# EAGLE design FanControl (EAGLE 6.5.0)
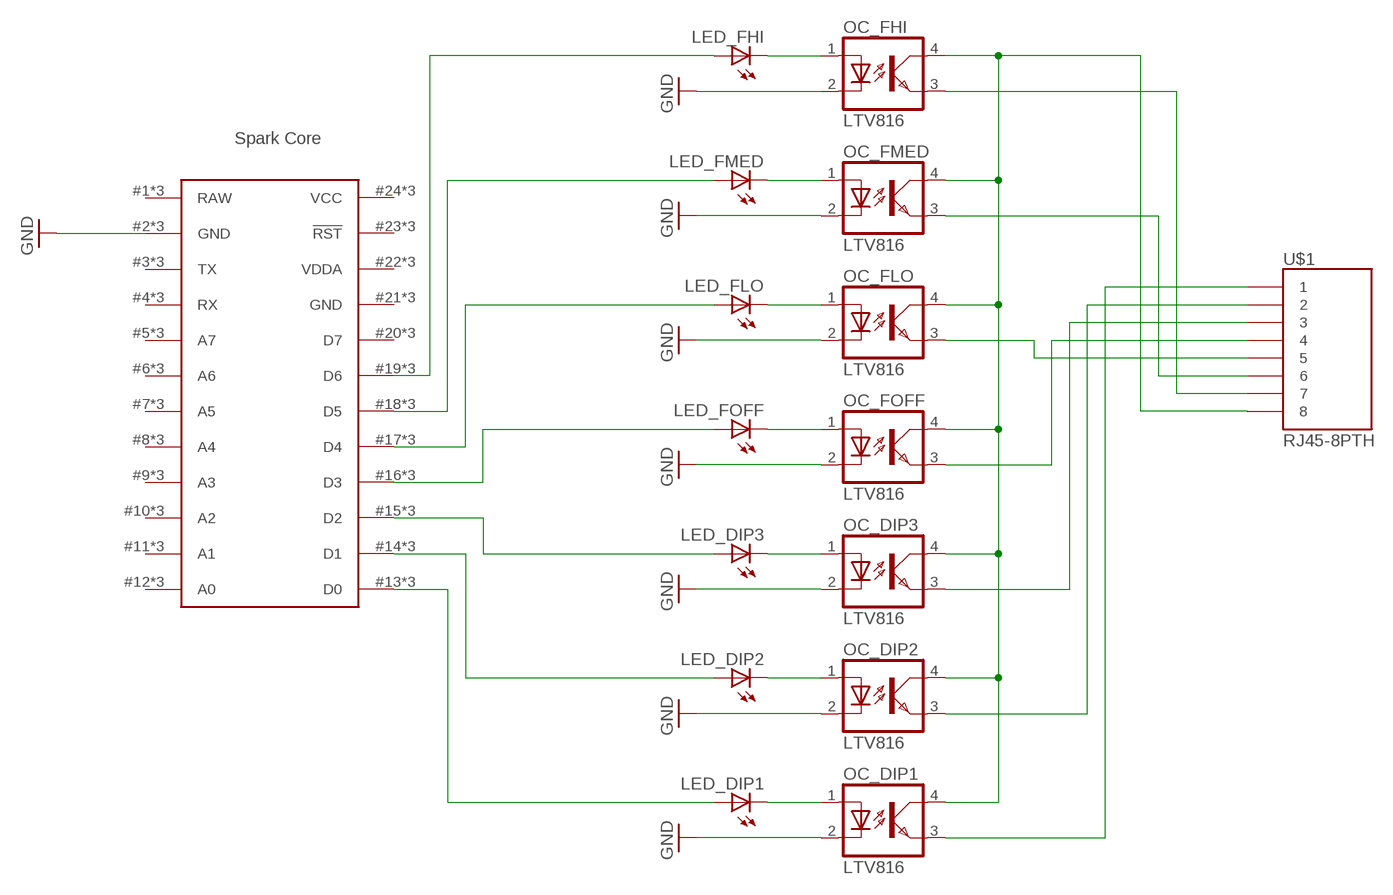
[diagram p0: schematic, sheet 1]

## Parts
LED_DIP1  LED3MM  [LED3MM]
LED_DIP2  LED3MM  [LED3MM]
LED_DIP3  LED3MM  [LED3MM]
LED_FHI  LED3MM  [LED3MM]
LED_FLO  LED3MM  [LED3MM]
LED_FMED  LED3MM  [LED3MM]
LED_FOFF  LED3MM  [LED3MM]
OC_DIP1  LTV816  [DIL04]
OC_DIP2  LTV816  [DIL04]
OC_DIP3  LTV816  [DIL04]
OC_FHI  LTV816  [DIL04]
OC_FLO  LTV816  [DIL04]
OC_FMED  LTV816  [DIL04]
OC_FOFF  LTV816  [DIL04]
U$1  RJ45-8PTH  [RJ45-8]
U$2  SPARK_CORE  [SPARK_CORE_STACKABLE]

## Nets
GND: OC_DIP1.2(C) OC_DIP2.2(C) OC_DIP3.2(C) OC_FHI.2(C) OC_FLO.2(C) OC_FMED.2(C) OC_FOFF.2(C) U$2.2(GND) U$2.#2(GND) U$2.@2(GND)
N$1: OC_DIP1.4(COL) OC_DIP2.4(COL) OC_DIP3.4(COL) OC_FHI.4(COL) OC_FLO.4(COL) OC_FMED.4(COL) OC_FOFF.4(COL) U$1.8
N$2: OC_DIP1.3(EMIT) U$1.1
N$3: OC_DIP2.3(EMIT) U$1.2
N$4: OC_DIP3.3(EMIT) U$1.3
N$5: OC_FOFF.3(EMIT) U$1.4
N$6: OC_FLO.3(EMIT) U$1.5
N$7: OC_FMED.3(EMIT) U$1.6
N$8: OC_FHI.3(EMIT) U$1.7
N$9: LED_FHI.K(C) OC_FHI.1(A)
N$10: LED_FMED.K(C) OC_FMED.1(A)
N$11: LED_FLO.K(C) OC_FLO.1(A)
N$12: LED_FOFF.K(C) OC_FOFF.1(A)
N$13: LED_DIP3.K(C) OC_DIP3.1(A)
N$14: LED_DIP2.K(C) OC_DIP2.1(A)
N$15: LED_DIP1.K(C) OC_DIP1.1(A)
N$16: LED_DIP1.A U$2.13(D0) U$2.#13(D0) U$2.@13(D0)
N$17: LED_DIP2.A U$2.14(D1) U$2.#14(D1) U$2.@14(D1)
N$18: LED_DIP3.A U$2.15(D2) U$2.#15(D2) U$2.@15(D2)
N$19: LED_FOFF.A U$2.16(D3) U$2.#16(D3) U$2.@16(D3)
N$20: LED_FLO.A U$2.17(D4) U$2.#17(D4) U$2.@17(D4)
N$21: LED_FMED.A U$2.18(D5) U$2.#18(D5) U$2.@18(D5)
N$22: LED_FHI.A U$2.19(D6) U$2.#19(D6) U$2.@19(D6)
Unconnected: U$2.3(TX) U$2.4(RX) U$2.5(A7) U$2.6(A6) U$2.7(A5) U$2.8(A4) U$2.9(A3) U$2.10(A2) U$2.11(A1) U$2.12(A0) U$2.20(D7) U$2.23(!RST) U$2.#3(TX) U$2.#4(RX) U$2.#5(A7) U$2.#6(A6) U$2.#7(A5) U$2.#8(A4) U$2.#9(A3) U$2.#10(A2) U$2.#11(A1) U$2.#12(A0) U$2.#20(D7) U$2.#23(!RST) U$2.@3(TX) U$2.@4(RX) U$2.@5(A7) U$2.@6(A6) U$2.@7(A5) U$2.@8(A4) U$2.@9(A3) U$2.@10(A2) U$2.@11(A1) U$2.@12(A0) U$2.@20(D7) U$2.@23(!RST)

## Notes on the sheet
- Spark Core

## Power pins joined to a net without a drawn wire
GND: U$2.21(GND) U$2.#21(GND) U$2.@21(GND)
RAW: U$2.1(RAW) U$2.#1(RAW) U$2.@1(RAW)
VCC: U$2.24(VCC) U$2.#24(VCC) U$2.@24(VCC)
VDDA: U$2.22(VDDA) U$2.#22(VDDA) U$2.@22(VDDA)

## Library data of the parts
LED_DIP1-LED_DIP3 LED_FHI LED_FLO LED_FMED LED_FOFF = SparkFun-LED:LED: LEDs Standard schematic elements and footprints for 5mm, 3mm, 1206, and 0603 sized LEDs. 5mm - Spark Fun Electronics SKU : COM-00529 (and others)
OC_DIP1-OC_DIP3 OC_FHI OC_FLO OC_FMED OC_FOFF = optocoupler:LTV816: OPTO COUPLER Source: LITEON, LTV816.pdf; OC_FARNELL: unknown; OC_NEWARK: unknown
U$1 = SparkFun-Connectors:RJ45-8: RJ45 Jack Simple RJ45, 8-pin connection - connector for common Cat5, Cat5e, and Cat6 Ethernet cables. Footprint not yet proven in production. Connector sku is PRT-00643; Breakout PCB sku is BOB-00716.
U$2 = Spark:SPARK_CORE

## Board
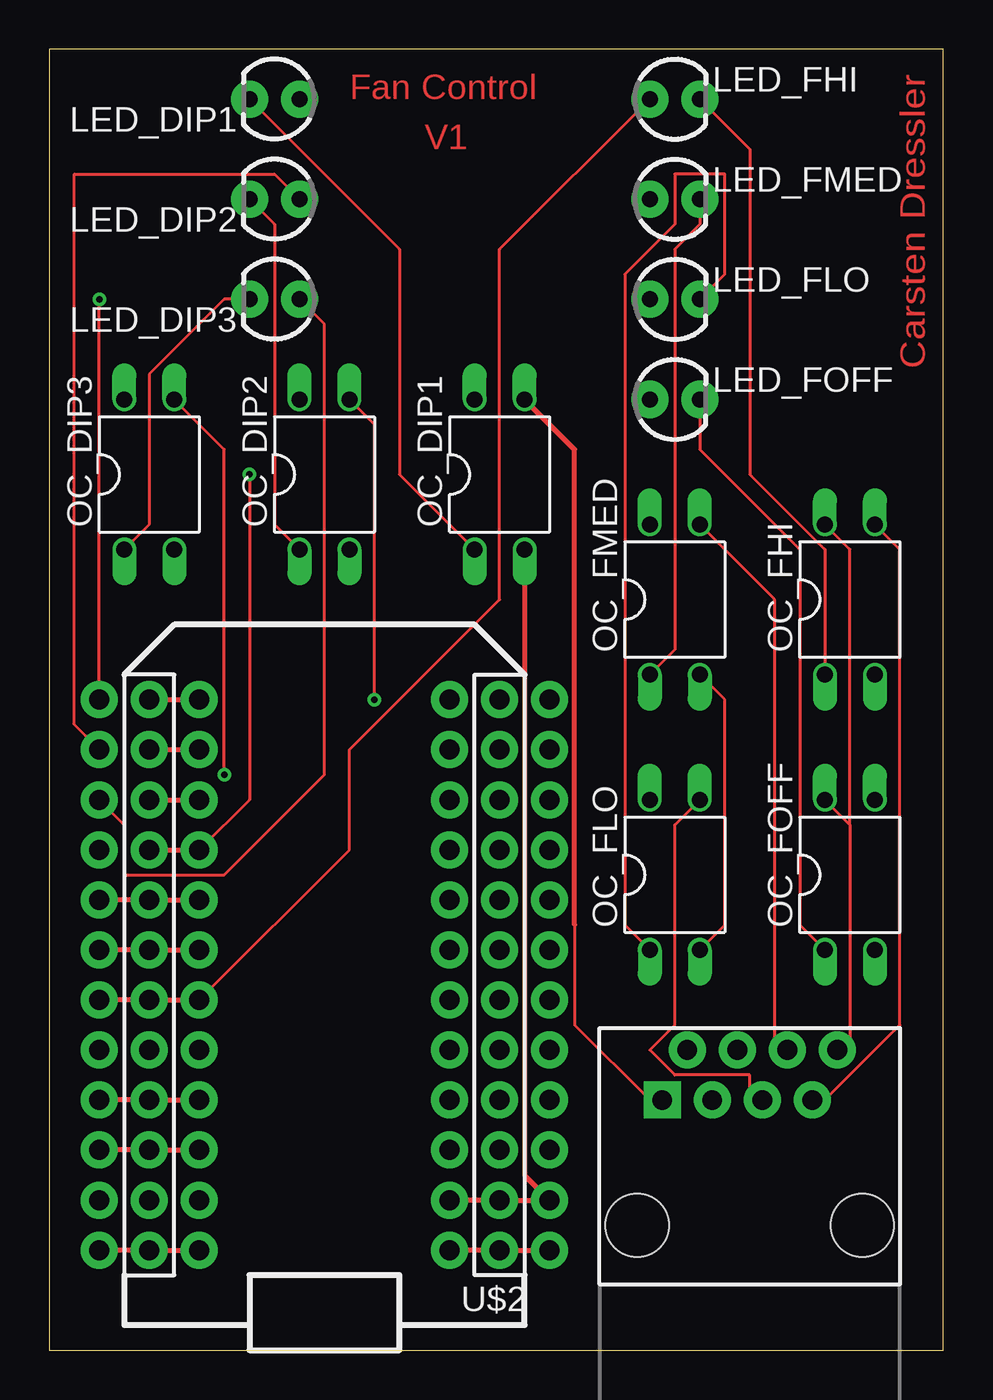
[diagram p1: board, top side]
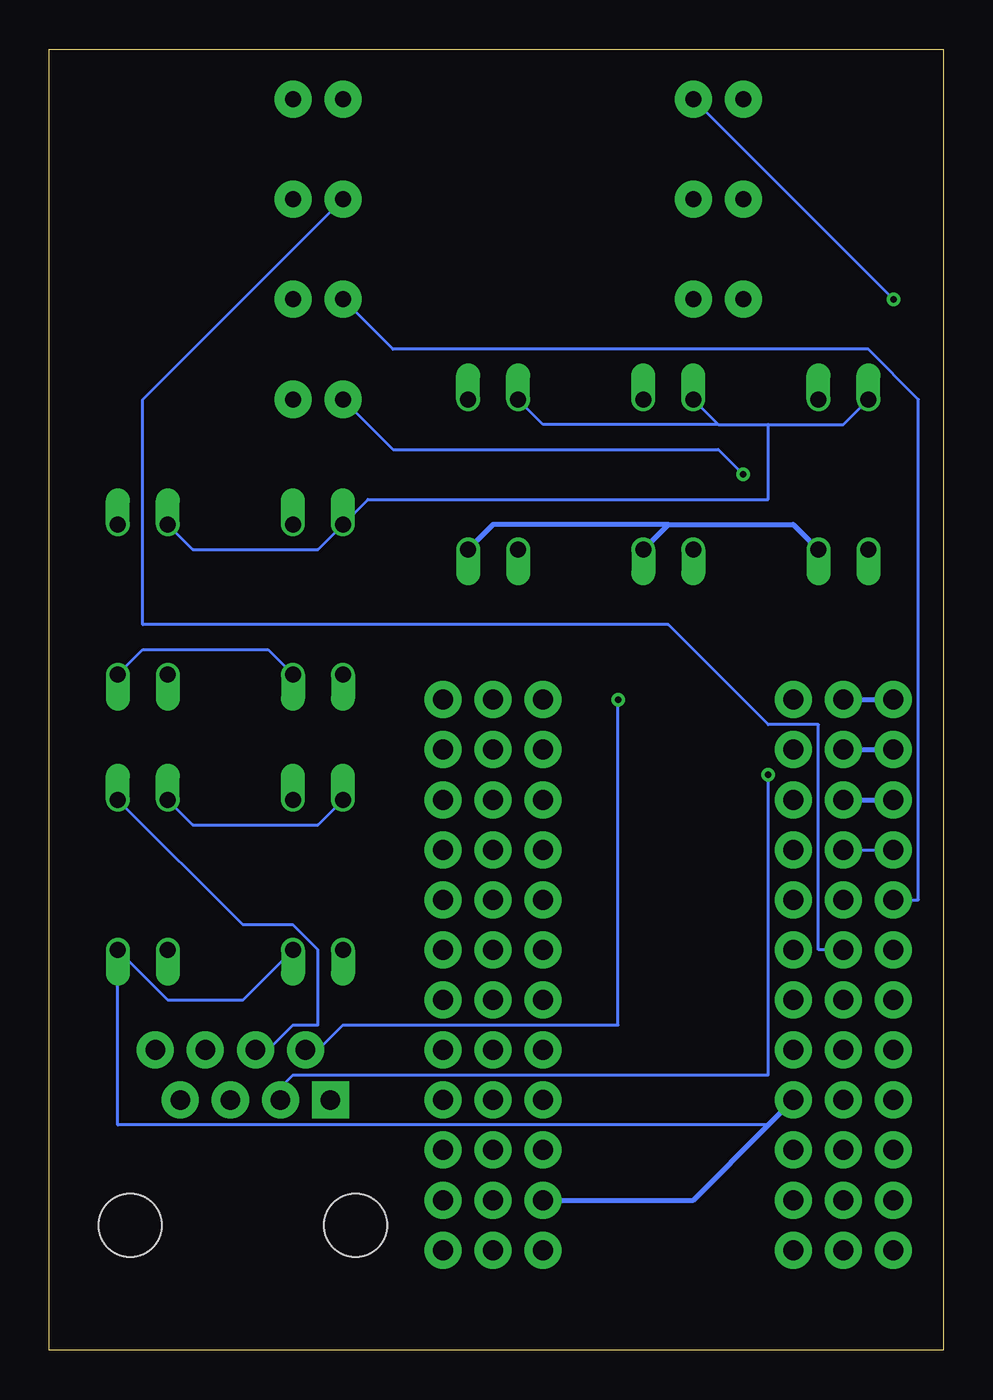
[diagram p2: board, bottom side, seen from below]

Size 45.39 x 66.03 mm. Coordinates in mm from the lower left corner, seen from the top.
Outline: 0,0 45.39,0 45.39,66.03 0,66.03 0,0
Copper layers (1*16): Top 0.0356mm / dielectric 1.5011mm / Bottom 0.0356mm
Design rules "LaenPCBOrder": minimum track width 6mil, minimum drill 13mil, track to track 6mil, track to pad 6mil, pad to pad 6mil, via to via 6mil, smd to smd 6mil, copper to edge 15mil, drill to drill 6mil, minimum pad ring 7mil, minimum via ring 7mil, stop-mask expansion 3mil, vias tented up to drill 0mil, thermal gap 10mil

### Footprints (pad centres in the part's own frame; a part is rotated, then mirrored left to right if it is on the bottom)
LED3MM = drill 0.813 pad 1.88: A -1.27,0; K 1.27,0
DIL04 = drill 0.813 offset: 1 -1.27,-3.81; 2 1.27,-3.81; 3 1.27,3.81; 4 -1.27,3.81
RJ45-8 = drill 1 pad 1.88 square: 1 -4.445,6.35 | drill 1 pad 1.88: 2 -3.175,8.89; 3 -1.905,6.35; 4 -0.635,8.89; 5 0.635,6.35; 6 1.905,8.89; 7 3.175,6.35; 8 4.445,8.89 | hole 3.2: -5.715,0; 5.715,0
SPARK_CORE_STACKABLE = drill 1.016 pad 1.88: 1 -8.89,13.97; 2 -8.89,11.43; 3 -8.89,8.89; 4 -8.89,6.35; 5 -8.89,3.81; 6 -8.89,1.27; 7 -8.89,-1.27; 8 -8.89,-3.81; 9 -8.89,-6.35; 10 -8.89,-8.89; 11 -8.89,-11.43; 12 -8.89,-13.97; 13 8.89,-13.97; 14 8.89,-11.43; 15 8.89,-8.89; 16 8.89,-6.35; 17 8.89,-3.81; 18 8.89,-1.27; 19 8.89,1.27; 20 8.89,3.81; 21 8.89,6.35; 22 8.89,8.89; 23 8.89,11.43; 24 8.89,13.97; #1 -6.35,13.97; #2 -6.35,11.43; #3 -6.35,8.89; #4 -6.35,6.35; #5 -6.35,3.81; #6 -6.35,1.27; #7 -6.35,-1.27; #8 -6.35,-3.81; #9 -6.35,-6.35; #10 -6.35,-8.89; #11 -6.35,-11.43; #12 -6.35,-13.97; #13 11.43,-13.97; #14 11.43,-11.43; #15 11.43,-8.89; #16 11.43,-6.35; #17 11.43,-3.81; #18 11.43,-1.27; #19 11.43,1.27; #20 11.43,3.81; #21 11.43,6.35; #22 11.43,8.89; #23 11.43,11.43; #24 11.43,13.97; @1 -11.43,13.97; @2 -11.43,11.43; @3 -11.43,8.89; @4 -11.43,6.35; @5 -11.43,3.81; @6 -11.43,1.27; @7 -11.43,-1.27; @8 -11.43,-3.81; @9 -11.43,-6.35; @10 -11.43,-8.89; @11 -11.43,-11.43; @12 -11.43,-13.97; @13 6.35,-13.97; @14 6.35,-11.43; @15 6.35,-8.89; @16 6.35,-6.35; @17 6.35,-3.81; @18 6.35,-1.27; @19 6.35,1.27; @20 6.35,3.81; @21 6.35,6.35; @22 6.35,8.89; @23 6.35,11.43; @24 6.35,13.97

### Placement (x,y rotation side)
LED_DIP1  11.43,63.5 180 top
LED_DIP2  11.43,58.42 180 top
LED_DIP3  11.43,53.34 180 top
LED_FHI  31.75,63.5 0 top
LED_FLO  31.75,53.34 0 top
LED_FMED  31.75,58.42 0 top
LED_FOFF  31.75,48.26 0 top
OC_DIP1  22.86,44.45 0 top
OC_DIP2  13.97,44.45 0 top
OC_DIP3  5.08,44.45 0 top
OC_FHI  40.64,38.1 0 top
OC_FLO  31.75,24.13 0 top
OC_FMED  31.75,38.1 0 top
OC_FOFF  40.64,24.13 0 top
U$1  35.56,6.35 0 top
U$2  13.97,19.05 180 top

### Tracks (layer width: path | path; a pad name or v marks a point on that pad's centre or on a via)
GND
  Top 0.152: OC_FMED.2 34.29,33.02 34.29,21.59 OC_FLO.2
  Top 0.254: U$2.#21 U$2.21 U$2.@21 | U$2.#2 U$2.2 U$2.@2 24.13,8.89 OC_DIP1.2
  Bottom 0.152: OC_FMED.2 34.29,35.56 40.64,35.56 OC_FHI.2 | OC_FLO.2 35.56,17.78 39.37,17.78 OC_FOFF.2 41.91,11.43 8.89,11.43
  Bottom 0.254: U$2.@21 8.89,11.43 12.7,7.62 U$2.#2 | OC_DIP3.2 7.62,41.91 13.97,41.91 | OC_DIP2.2 13.97,41.91 | OC_DIP1.2 22.86,41.91 13.97,41.91
N$1
  Top 0.152: 40.64,26.67 40.64,15.24 U$1.8 | OC_FOFF.4 40.64,26.67 | OC_FHI.4 40.64,40.64 40.64,26.67
  Bottom 0.152: OC_DIP3.4 5.08,46.99 8.89,46.99 | 11.43,46.99 8.89,46.99 | OC_DIP2.4 11.43,46.99 | OC_DIP1.4 20.32,46.99 11.43,46.99 | OC_FHI.4 38.1,40.64 31.75,40.64 OC_FMED.4 29.21,43.18 8.89,43.18 8.89,46.99 | OC_FLO.4 31.75,26.67 38.1,26.67 OC_FOFF.4
N$2
  Top 0.152: 26.67,21.59 26.67,16.51 30.48,12.7 U$1.1
  Top 0.254: OC_DIP1.3 26.67,45.72 26.67,21.59
N$3  (via drill 0.33)
  Top 0.152: OC_DIP2.3 16.51,46.99 v16.51,33.02
  Bottom 0.152: v16.51,33.02 16.51,16.51 30.48,16.51 31.75,15.24 U$1.2
N$4  (via drill 0.33)
  Top 0.152: OC_DIP3.3 8.89,45.72 v8.89,29.21
  Bottom 0.152: v8.89,29.21 8.89,13.97 33.02,13.97 34.29,12.7 U$1.3
N$5
  Bottom 0.152: OC_FOFF.3 35.56,21.59 33.02,21.59 31.75,20.32 31.75,16.51 33.02,16.51 34.29,15.24 U$1.4
N$6
  Top 0.152: OC_FLO.3 31.75,26.67 31.75,16.51 30.48,15.24 31.75,13.97 35.56,13.97 35.56,12.7 U$1.5
N$7
  Top 0.152: OC_FMED.3 36.83,38.1 36.83,15.24 U$1.6
N$8
  Top 0.152: OC_FHI.3 43.18,40.64 43.18,16.51 39.37,12.7 U$1.7
N$9
  Top 0.152: OC_FHI.1 39.37,40.64 35.56,44.45 35.56,60.96 LED_FHI.K
N$10
  Top 0.152: OC_FMED.1 31.75,35.56 31.75,55.88 33.02,57.15 LED_FMED.K
N$11
  Top 0.152: OC_FLO.1 29.21,21.59 29.21,54.61 31.75,57.15 31.75,59.69 34.29,59.69 34.29,54.61 LED_FLO.K
N$12
  Top 0.152: OC_FOFF.1 38.1,21.59 38.1,40.64 33.02,45.72 LED_FOFF.K
N$13
  Top 0.152: OC_DIP3.1 5.08,41.91 5.08,49.53 8.89,53.34 LED_DIP3.K
N$14
  Top 0.152: OC_DIP2.1 11.43,41.91 11.43,57.15 LED_DIP2.K
N$15
  Top 0.152: OC_DIP1.1 17.78,44.45 17.78,55.88 LED_DIP1.K
N$16  (via drill 0.33)
  Top 0.152: U$2.#13 v2.54,53.34
  Top 0.254: U$2.13 U$2.@13
  Bottom 0.152: v2.54,53.34 LED_DIP1.A
  Bottom 0.254: U$2.13 U$2.#13
N$17
  Top 0.152: LED_DIP2.A 11.43,59.69 1.27,59.69 1.27,31.75 U$2.#14
  Top 0.254: U$2.14 U$2.@14
  Bottom 0.254: U$2.14 U$2.#14
N$18
  Top 0.152: LED_DIP3.A 13.97,52.07 13.97,29.21 8.89,24.13 3.81,24.13 3.81,26.67 U$2.#15
  Top 0.254: U$2.15 U$2.@15
  Bottom 0.254: U$2.15 U$2.#15
N$19  (via drill 0.33)
  Top 0.152: U$2.@16 10.16,27.94 v10.16,44.45
  Top 0.254: U$2.16 U$2.@16
  Bottom 0.152: U$2.16 U$2.#16 | v10.16,44.45 11.43,45.72 27.94,45.72 LED_FOFF.A
N$20
  Top 0.254: U$2.#17 U$2.17 U$2.@17
  Bottom 0.152: LED_FLO.A 27.94,50.8 3.81,50.8 1.27,48.26 1.27,22.86 U$2.#17
N$21
  Top 0.254: U$2.#18 U$2.18 U$2.@18
  Bottom 0.152: LED_FMED.A 40.64,48.26 40.64,36.83 13.97,36.83 8.89,31.75 6.35,31.75 6.35,20.32 U$2.18
N$22
  Top 0.152: LED_FHI.A 22.86,55.88 22.86,38.1 15.24,30.48 15.24,25.4 U$2.@19
  Top 0.254: U$2.#19 U$2.19 U$2.@19
RAW
  Top 0.254: U$2.#1 U$2.1 U$2.@1
VCC
  Top 0.254: U$2.#24 U$2.24 U$2.@24
VDDA
  Top 0.254: U$2.#22 U$2.22 U$2.@22

### Text on the board
Top: Carsten Dressler | Fan Control | V1